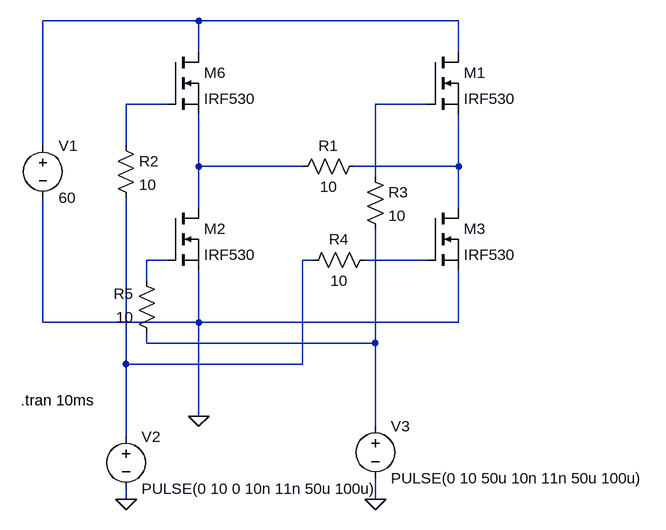
[diagram p0: schematic DCAC_Converter_LTspice.asc]
DCAC_Converter_LTspice.asc, the LTspice schematic file:
Version 4
SHEET 1 880 680
WIRE -48 -240 -288 -240
WIRE 352 -240 -48 -240
WIRE -48 -192 -48 -240
WIRE 352 -192 352 -240
WIRE -96 -112 -160 -112
WIRE 304 -112 224 -112
WIRE -288 -48 -288 -240
WIRE -160 -48 -160 -112
WIRE -48 -16 -48 -96
WIRE 112 -16 -48 -16
WIRE 352 -16 352 -96
WIRE 352 -16 192 -16
WIRE 224 0 224 -112
WIRE -48 48 -48 -16
WIRE 352 48 352 -16
WIRE -96 128 -128 128
WIRE 128 128 112 128
WIRE 304 128 208 128
WIRE -128 160 -128 128
WIRE -288 224 -288 32
WIRE -48 224 -48 144
WIRE -48 224 -288 224
WIRE 352 224 352 144
WIRE 352 224 -48 224
WIRE -128 256 -128 240
WIRE 224 256 224 80
WIRE 224 256 -128 256
WIRE -160 288 -160 32
WIRE 112 288 112 128
WIRE 112 288 -160 288
WIRE -48 368 -48 224
WIRE 224 384 224 256
WIRE -160 400 -160 288
WIRE -160 496 -160 480
WIRE 224 496 224 464
FLAG -160 496 0
FLAG 224 496 0
FLAG -48 368 0
SYMBOL voltage -288 -64 R0
WINDOW 123 0 0 Left 0
WINDOW 39 0 0 Left 0
SYMATTR InstName V1
SYMATTR Value 60
SYMBOL nmos -96 48 R0
SYMATTR InstName M2
SYMATTR Value IRF530
SYMBOL res 208 -32 R90
WINDOW 0 0 56 VBottom 2
WINDOW 3 32 56 VTop 2
SYMATTR InstName R1
SYMATTR Value 10
SYMBOL voltage -160 384 R0
WINDOW 123 0 0 Left 0
WINDOW 39 0 0 Left 0
SYMATTR InstName V2
SYMATTR Value PULSE(0 10 0 10n 11n 50u 100u)
SYMBOL voltage 224 368 R0
WINDOW 123 0 0 Left 0
WINDOW 39 0 0 Left 0
SYMATTR InstName V3
SYMATTR Value PULSE(0 10 50u 10n 11n 50u 100u)
SYMBOL nmos -96 -192 R0
SYMATTR InstName M6
SYMATTR Value IRF530
SYMBOL nmos 304 -192 R0
SYMATTR InstName M1
SYMATTR Value IRF530
SYMBOL nmos 304 48 R0
SYMATTR InstName M3
SYMATTR Value IRF530
SYMBOL res -176 -64 R0
SYMATTR InstName R2
SYMATTR Value 10
SYMBOL res 208 -16 R0
SYMATTR InstName R3
SYMATTR Value 10
SYMBOL res 224 112 R90
WINDOW 0 0 56 VBottom 2
WINDOW 3 32 56 VTop 2
SYMATTR InstName R4
SYMATTR Value 10
SYMBOL res -112 256 R180
WINDOW 0 36 76 Left 2
WINDOW 3 36 40 Left 2
SYMATTR InstName R5
SYMATTR Value 10
TEXT -322 344 Left 2 !.tran 10ms

The netlist it stands for:
* DCAC_Converter_LTspice.asc
V1 N001 0 60
M2 N004 N006 0 0 IRF530
R1 N005 N004 10
V2 N007 0 PULSE(0 10 0 10n 11n 50u 100u)
V3 N009 0 PULSE(0 10 50u 10n 11n 50u 100u)
M6 N001 N002 N004 N004 IRF530
M1 N001 N003 N005 N005 IRF530
M3 N005 N008 0 0 IRF530
R2 N002 N007 10
R3 N003 N009 10
R4 N008 N007 10
R5 N009 N006 10
.model NMOS NMOS
.model PMOS PMOS
.lib standard.mos
.tran 10ms
.backanno
.end